# Altium schematic sheet 24-BOOT MODE BUFFER AND SWITCHES.SchDoc
size 513 x 386 mm
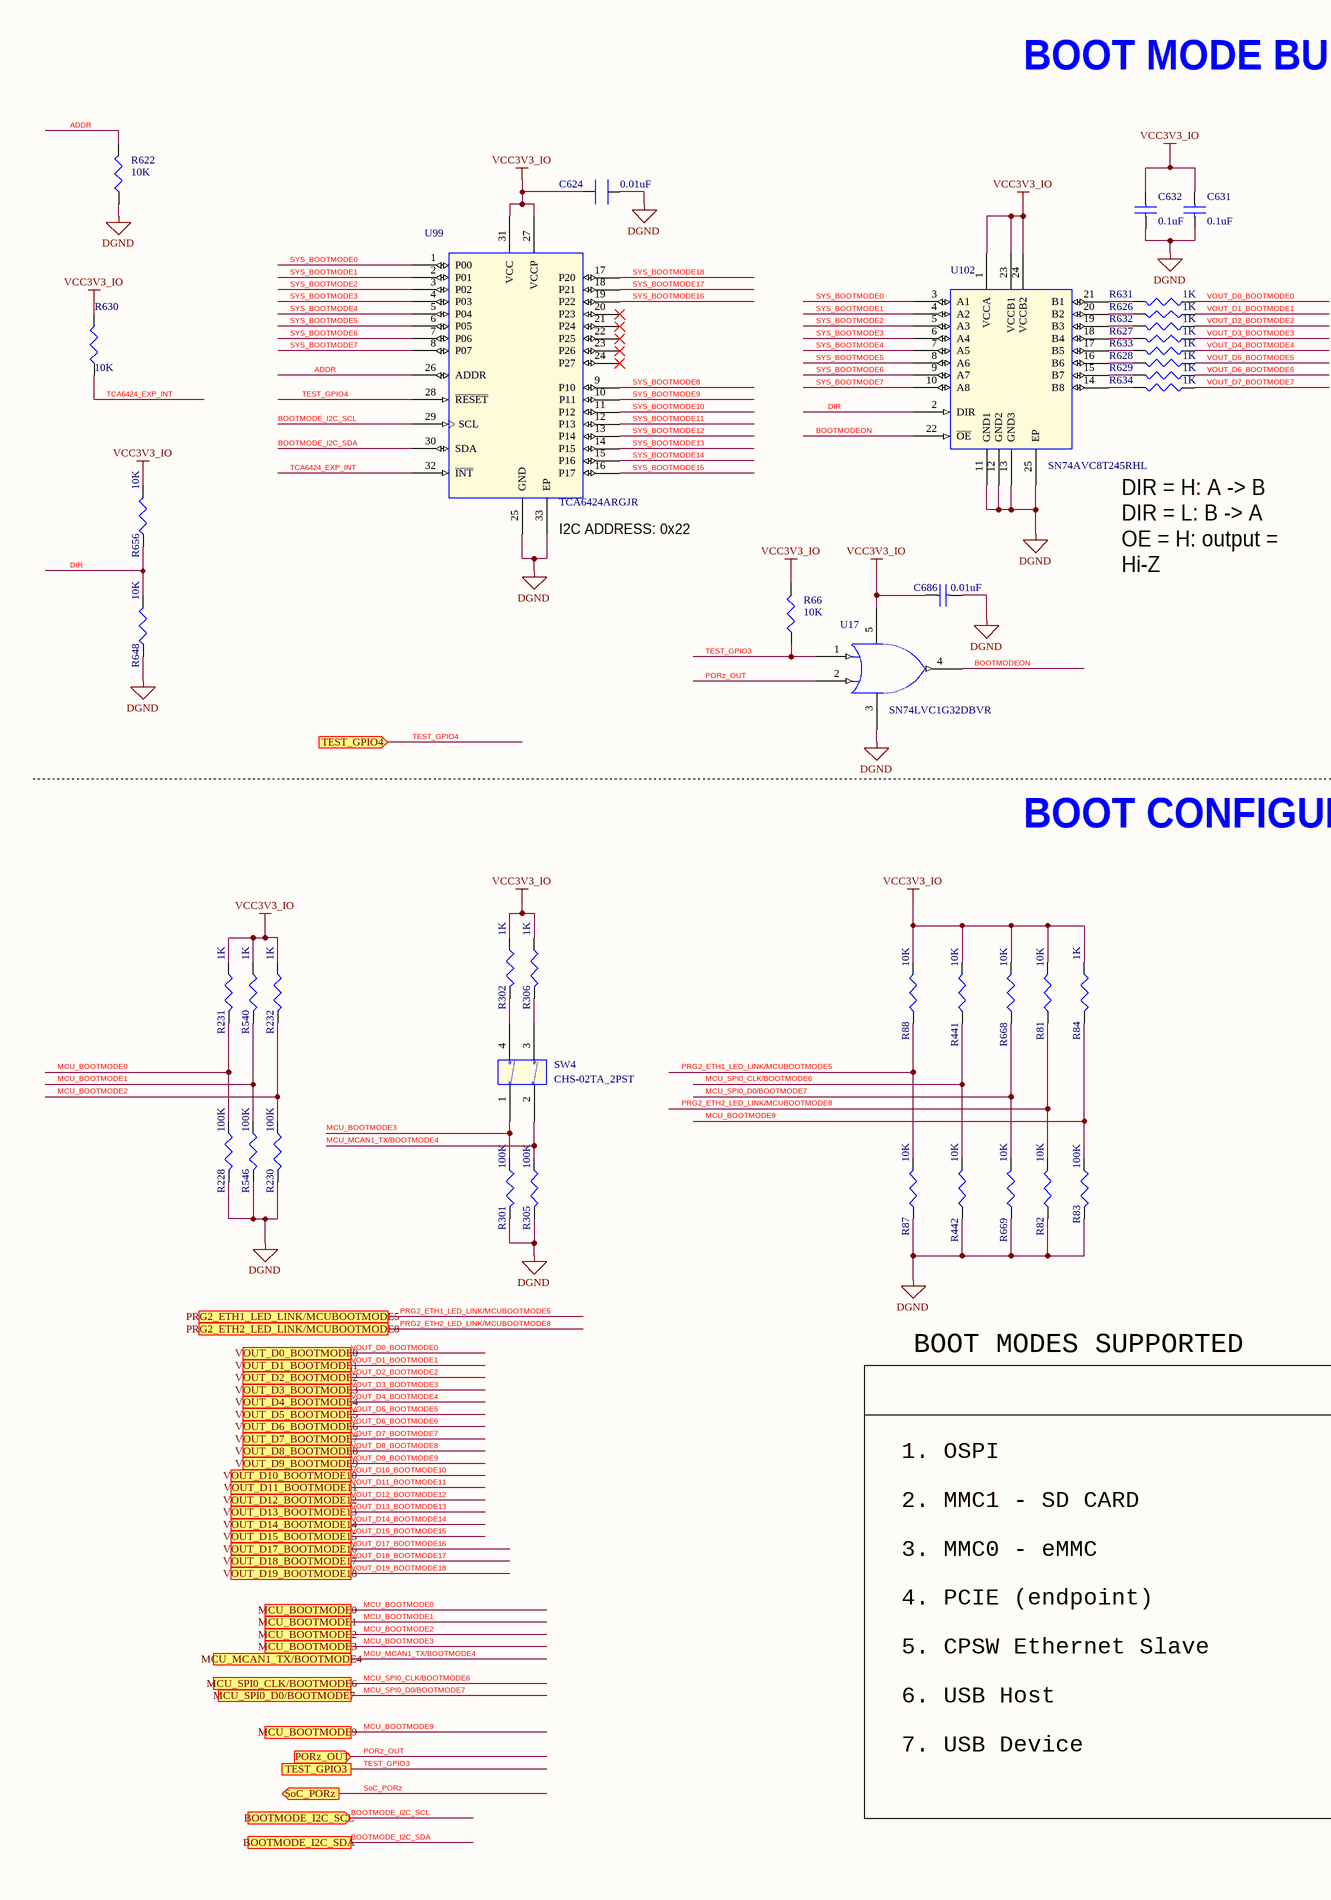
[diagram p0: 24-BOOT MODE BUFFER AND SWITCHES.SchDoc, left]
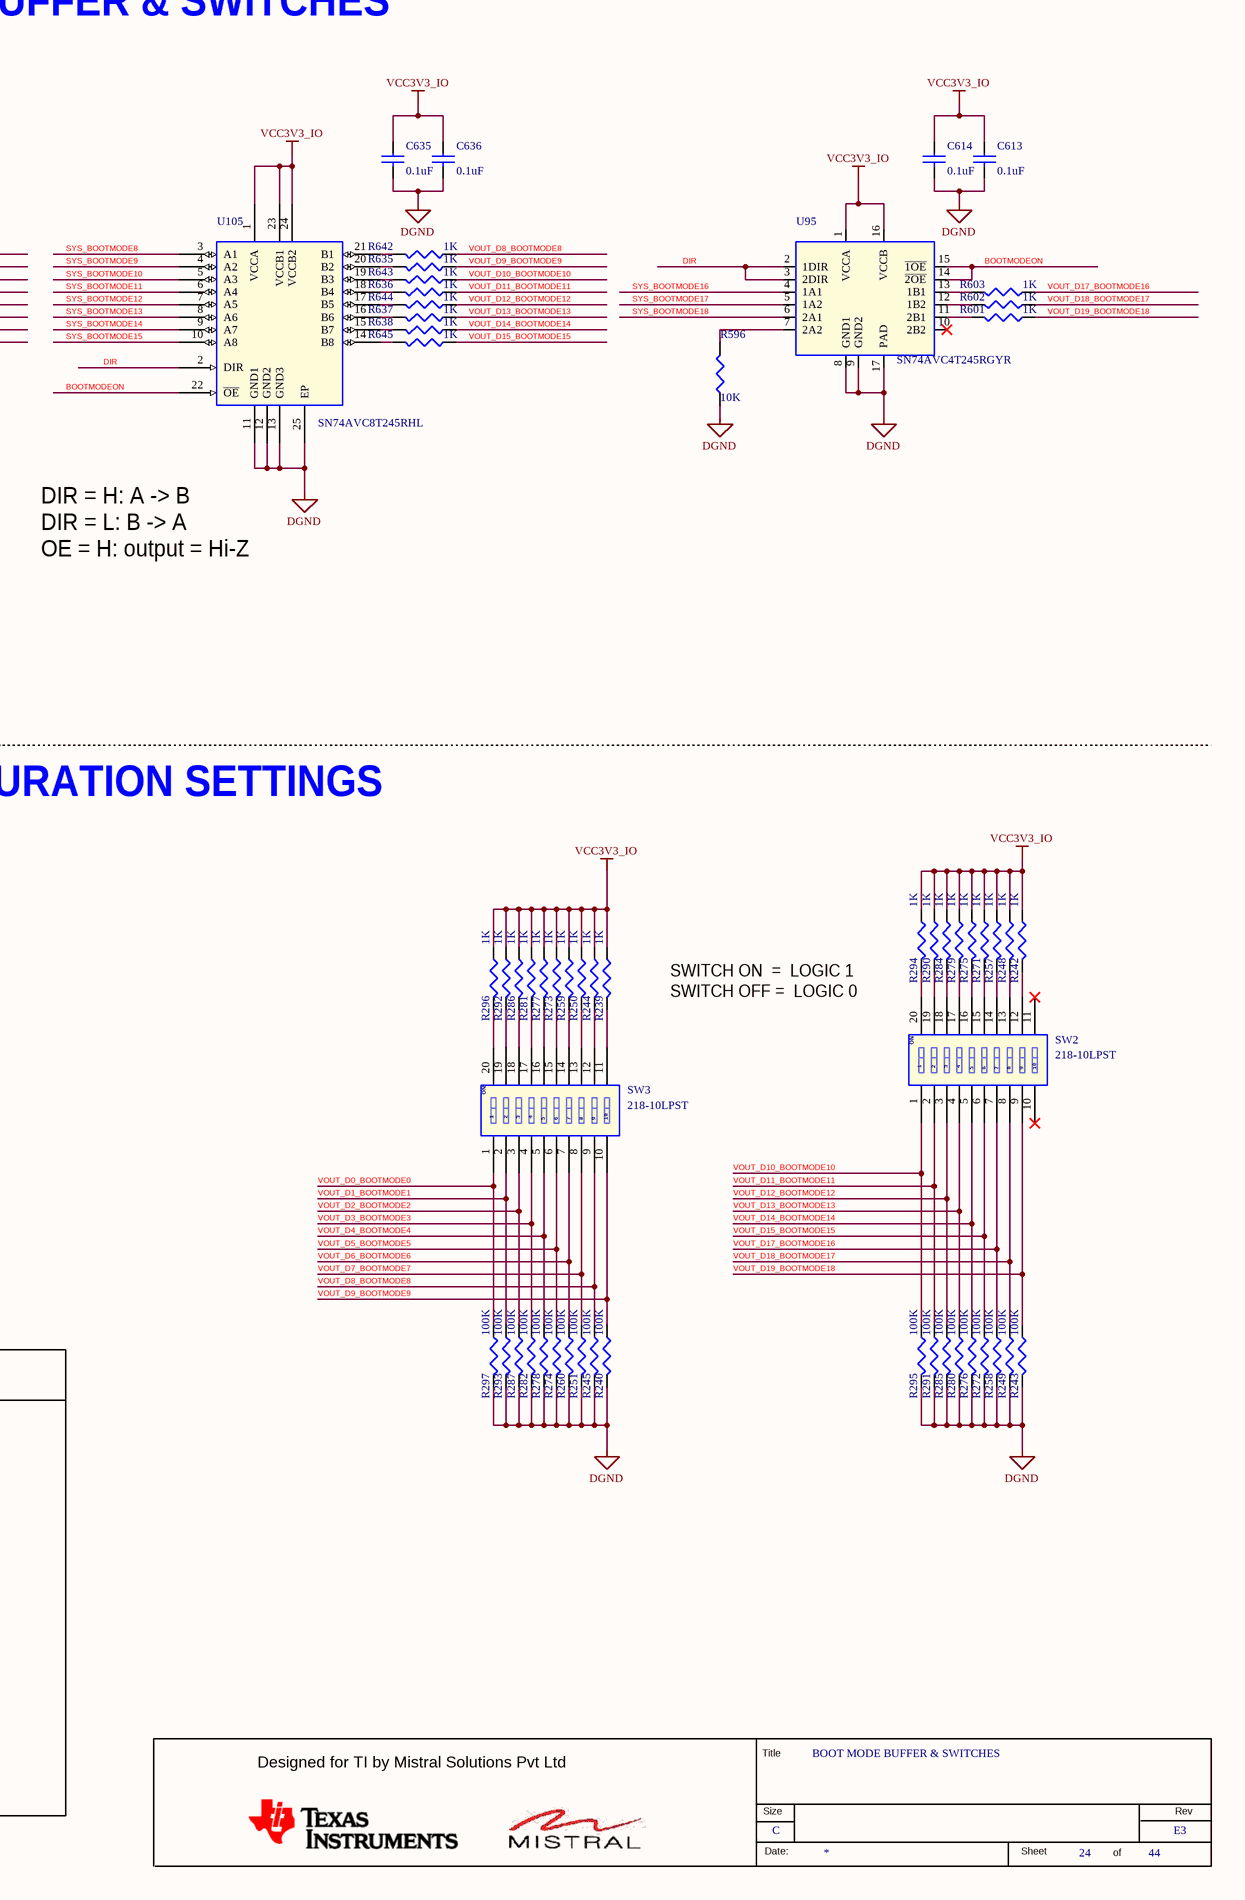
[diagram p1: 24-BOOT MODE BUFFER AND SWITCHES.SchDoc, right]

## Parts
*  RevCode: E3  Title: BOOT MODE BUFFER & SWITCHES  Page Size: C  Page Number: 24  Page Count: 44  (hidden comment: MISTRAL_TITLEBLK_CSIZE)  (graphical)
C613  0.1uF  [CAP0201_0-5]
C614  0.1uF  [CAP0201_0-5]
C624  0.01uF  [CAP0201_0-5]
C631  0.1uF  [CAP0201_0-5]
C632  0.1uF  [CAP0201_0-5]
C635  0.1uF  [CAP0201_0-5]
C636  0.1uF  [CAP0201_0-5]
C686  0.01uF  [CAP0201_0-5]
R66  10K  [RES0402_0-5]
R81  10K  [RES0402_0-5]
R82  10K  [RES0402_0-5]
R83  100K  [RES0402_0-5]
R84  1K  [RES0402]
R87  10K  [RES0402_0-5]
R88  10K  [RES0402_0-5]
R228  100K  [RES0402_0-5]
R230  100K  [RES0402_0-5]
R231  1K  [RES0201]
R232  1K  [RES0201]
R239  1K  [RES0201]
R240  100K  [RES0402_0-5]
R242  1K  [RES0201]
R243  100K  [RES0402_0-5]
R244  1K  [RES0201]
R245  100K  [RES0402_0-5]
R248  1K  [RES0201]
R249  100K  [RES0402_0-5]
R250  1K  [RES0201]
R251  100K  [RES0402_0-5]
R257  1K  [RES0201]
R258  100K  [RES0402_0-5]
R259  1K  [RES0201]
R260  100K  [RES0402_0-5]
R271  1K  [RES0201]
R272  100K  [RES0402_0-5]
R273  1K  [RES0201]
R274  100K  [RES0402_0-5]
R275  1K  [RES0201]
R276  100K  [RES0402_0-5]
R277  1K  [RES0201]
R278  100K  [RES0402_0-5]
R279  1K  [RES0201]
R280  100K  [RES0402_0-5]
R281  1K  [RES0201]
R282  100K  [RES0402_0-5]
R284  1K  [RES0201]
R285  100K  [RES0402_0-5]
R286  1K  [RES0201]
R287  100K  [RES0402_0-5]
R290  1K  [RES0201]
R291  100K  [RES0402_0-5]
R292  1K  [RES0201]
R293  100K  [RES0402_0-5]
R294  1K  [RES0201]
R295  100K  [RES0402_0-5]
R296  1K  [RES0201]
R297  100K  [RES0402_0-5]
R301  100K  [RES0402_0-5]
R302  1K  [RES0201]
R305  100K  [RES0402_0-5]
R306  1K  [RES0201]
R441  10K  [RES0402_0-5]
R442  10K  [RES0402_0-5]
R540  1K  [RES0201]
R546  100K  [RES0402_0-5]
R596  10K  [RES0402_0-5]
R601  1K  [RES0201]
R602  1K  [RES0201]
R603  1K  [RES0201]
R622  10K  [RES0402_0-5]
R626  1K  [RES0201]
R627  1K  [RES0201]
R628  1K  [RES0201]
R629  1K  [RES0201]
R630  10K  [RES0402_0-5]
R631  1K  [RES0201]
R632  1K  [RES0201]
R633  1K  [RES0201]
R634  1K  [RES0201]
R635  1K  [RES0201]
R636  1K  [RES0201]
R637  1K  [RES0201]
R638  1K  [RES0201]
R642  1K  [RES0201]
R643  1K  [RES0201]
R644  1K  [RES0201]
R645  1K  [RES0201]
R648  10K  [RES0402_0-5]
R656  10K  [RES0402_0-5]
R668  10K  [RES0402_0-5]
R669  10K  [RES0402_0-5]
SW2  218-10LPST  [SW10_50_550X230_SMD]
SW3  218-10LPST  [SW10_50_550X230_SMD]
SW4  CHS-02TA_2PST  [SW2_50x200_160x210_SMD]
U17  SN74LVC1G32DBVR  [SOT23-5_1-5]
U95  SN74AVC4T245RGYR  [QFN16_19-68_160X140]
U99  TCA6424ARGJR  [QFN32_19-68_200X200]
U102  SN74AVC8T245RHL  [QFN24_19-68_220X140_1]
U105  SN74AVC8T245RHL  [QFN24_19-68_220X140_1]

## Ports
BOOTMODE_I2C_SCL (in), BOOTMODE_I2C_SDA, MCU_BOOTMODE0, MCU_BOOTMODE1, MCU_BOOTMODE2, MCU_BOOTMODE3, MCU_BOOTMODE9, MCU_MCAN1_TX/BOOTMODE4, MCU_SPI0_CLK/BOOTMODE6, MCU_SPI0_D0/BOOTMODE7, PORz_OUT (in), PRG2_ETH1_LED_LINK/MCUBOOTMODE5, PRG2_ETH2_LED_LINK/MCUBOOTMODE8, SoC_PORz (out), TEST_GPIO3, TEST_GPIO4 (in), VOUT_D0_BOOTMODE0, VOUT_D1_BOOTMODE1, VOUT_D2_BOOTMODE2, VOUT_D3_BOOTMODE3, VOUT_D4_BOOTMODE4, VOUT_D5_BOOTMODE5, VOUT_D6_BOOTMODE6, VOUT_D7_BOOTMODE7, VOUT_D8_BOOTMODE8, VOUT_D9_BOOTMODE9, VOUT_D10_BOOTMODE10, VOUT_D11_BOOTMODE11, VOUT_D12_BOOTMODE12, VOUT_D13_BOOTMODE13, VOUT_D14_BOOTMODE14, VOUT_D15_BOOTMODE15, VOUT_D17_BOOTMODE16, VOUT_D18_BOOTMODE17, VOUT_D19_BOOTMODE18

## Nets
DGND: C613.2 C614.2 C624.1 C631.2 C632.2 C635.2 C636.2 C686.2 R82.1 R83.2 R87.1 R228.2 R230.2 R240.2 R243.2 R245.2 R249.2 R251.2 R258.2 R260.2 R272.2 R274.2 R276.2 R278.2 R280.2 R282.2 R285.2 R287.2 R291.2 R293.2 R295.2 R297.2 R301.2 R305.2 R442.1 R546.2 R596.1 R622.1 R648.1 R669.1 U17.3(GND) U95.8(GND1) U95.9(GND2) U95.17(PAD) U99.25(GND) U99.33(EP) U102.11(GND1) U102.12(GND2) U102.13(GND3) U102.25(EP) U105.11(GND1) U105.12(GND2) U105.13(GND3) U105.25(EP)
VCC3V3_IO: C613.1 C614.1 C624.2 C631.1 C632.1 C635.1 C636.1 C686.1 R66.2 R81.2 R84.1 R88.2 R231.1 R232.1 R239.1 R242.1 R244.1 R248.1 R250.1 R257.1 R259.1 R271.1 R273.1 R275.1 R277.1 R279.1 R281.1 R284.1 R286.1 R290.1 R292.1 R294.1 R296.1 R302.1 R306.1 R441.2 R540.1 R630.2 R656.2 R668.2 U17.5(VCC) U95.1(VCCA) U95.16(VCCB) U99.27(VCCP) U99.31(VCC) U102.1(VCCA) U102.23(VCCB1) U102.24(VCCB2) U105.1(VCCA) U105.23(VCCB1) U105.24(VCCB2)
ADDR: R622.2 U99.26(ADDR)
BOOTMODE_I2C_SCL: U99.29(SCL) ; port BOOTMODE_I2C_SCL
BOOTMODE_I2C_SDA: U99.30(SDA) ; port BOOTMODE_I2C_SDA
BOOTMODEON: U17.4(Y) U95.14(~{2OE}) U95.15(~{1OE}) U102.22(~{OE}) U105.22(~{OE})
DIR: R648.2 R656.1 U95.2(1DIR) U95.3(2DIR) U102.2(DIR) U105.2(DIR)
MCU_BOOTMODE0: R228.1 R231.2 ; port MCU_BOOTMODE0
MCU_BOOTMODE1: R540.2 R546.1 ; port MCU_BOOTMODE1
MCU_BOOTMODE2: R230.1 R232.2 ; port MCU_BOOTMODE2
MCU_BOOTMODE3: R301.1 SW4.1(A1) ; port MCU_BOOTMODE3
MCU_BOOTMODE9: R83.1 R84.2 ; port MCU_BOOTMODE9
MCU_MCAN1_TX/BOOTMODE4: R305.1 SW4.2(A2) ; port MCU_MCAN1_TX/BOOTMODE4
MCU_SPI0_CLK/BOOTMODE6: R441.1 R442.2 ; port MCU_SPI0_CLK/BOOTMODE6
MCU_SPI0_D0/BOOTMODE7: R668.1 R669.2 ; port MCU_SPI0_D0/BOOTMODE7
PORz_OUT: U17.2(B) ; port PORz_OUT
PRG2_ETH1_LED_LINK/MCUBOOTMODE5: R87.2 R88.1 ; port PRG2_ETH1_LED_LINK/MCUBOOTMODE5
PRG2_ETH2_LED_LINK/MCUBOOTMODE8: R81.1 R82.2 ; port PRG2_ETH2_LED_LINK/MCUBOOTMODE8
SoC_PORz: port SoC_PORz
SYS_BOOTMODE0: U99.1(P00) U102.3(A1)
SYS_BOOTMODE1: U99.2(P01) U102.4(A2)
SYS_BOOTMODE2: U99.3(P02) U102.5(A3)
SYS_BOOTMODE3: U99.4(P03) U102.6(A4)
SYS_BOOTMODE4: U99.5(P04) U102.7(A5)
SYS_BOOTMODE5: U99.6(P05) U102.8(A6)
SYS_BOOTMODE6: U99.7(P06) U102.9(A7)
SYS_BOOTMODE7: U99.8(P07) U102.10(A8)
SYS_BOOTMODE8: U99.9(P10) U105.3(A1)
SYS_BOOTMODE9: U99.10(P11) U105.4(A2)
SYS_BOOTMODE10: U99.11(P12) U105.5(A3)
SYS_BOOTMODE11: U99.12(P13) U105.6(A4)
SYS_BOOTMODE12: U99.13(P14) U105.7(A5)
SYS_BOOTMODE13: U99.14(P15) U105.8(A6)
SYS_BOOTMODE14: U99.15(P16) U105.9(A7)
SYS_BOOTMODE15: U99.16(P17) U105.10(A8)
SYS_BOOTMODE16: U95.4(1A1) U99.19(P22)
SYS_BOOTMODE17: U95.5(1A2) U99.18(P21)
SYS_BOOTMODE18: U95.6(2A1) U99.17(P20)
TCA6424_EXP_INT: R630.1 U99.32(~{INT})
TEST_GPIO3: R66.1 U17.1(A) ; port TEST_GPIO3
TEST_GPIO4: U99.28(~{RESET}) ; port TEST_GPIO4
VOUT_D0_BOOTMODE0: R297.1 R631.1 SW3.1 ; port VOUT_D0_BOOTMODE0
VOUT_D1_BOOTMODE1: R293.1 R626.1 SW3.2 ; port VOUT_D1_BOOTMODE1
VOUT_D2_BOOTMODE2: R287.1 R632.1 SW3.3 ; port VOUT_D2_BOOTMODE2
VOUT_D3_BOOTMODE3: R282.1 R627.1 SW3.4 ; port VOUT_D3_BOOTMODE3
VOUT_D4_BOOTMODE4: R278.1 R633.1 SW3.5 ; port VOUT_D4_BOOTMODE4
VOUT_D5_BOOTMODE5: R274.1 R628.1 SW3.6 ; port VOUT_D5_BOOTMODE5
VOUT_D6_BOOTMODE6: R260.1 R629.1 SW3.7 ; port VOUT_D6_BOOTMODE6
VOUT_D7_BOOTMODE7: R251.1 R634.1 SW3.8 ; port VOUT_D7_BOOTMODE7
VOUT_D8_BOOTMODE8: R245.1 R642.1 SW3.9 ; port VOUT_D8_BOOTMODE8
VOUT_D9_BOOTMODE9: R240.1 R635.1 SW3.10 ; port VOUT_D9_BOOTMODE9
VOUT_D10_BOOTMODE10: R295.1 R643.1 SW2.1 ; port VOUT_D10_BOOTMODE10
VOUT_D11_BOOTMODE11: R291.1 R636.1 SW2.2 ; port VOUT_D11_BOOTMODE11
VOUT_D12_BOOTMODE12: R285.1 R644.1 SW2.3 ; port VOUT_D12_BOOTMODE12
VOUT_D13_BOOTMODE13: R280.1 R637.1 SW2.4 ; port VOUT_D13_BOOTMODE13
VOUT_D14_BOOTMODE14: R276.1 R638.1 SW2.5 ; port VOUT_D14_BOOTMODE14
VOUT_D15_BOOTMODE15: R272.1 R645.1 SW2.6 ; port VOUT_D15_BOOTMODE15
VOUT_D17_BOOTMODE16: R258.1 R603.1 SW2.7 ; port VOUT_D17_BOOTMODE16
VOUT_D18_BOOTMODE17: R249.1 R602.1 SW2.8 ; port VOUT_D18_BOOTMODE17
VOUT_D19_BOOTMODE18: R243.1 R601.1 SW2.9 ; port VOUT_D19_BOOTMODE18
NetR239_2: R239.2 SW3.11
NetR242_2: R242.2 SW2.12
NetR244_2: R244.2 SW3.12
NetR248_2: R248.2 SW2.13
NetR250_2: R250.2 SW3.13
NetR257_2: R257.2 SW2.14
NetR259_2: R259.2 SW3.14
NetR271_2: R271.2 SW2.15
NetR273_2: R273.2 SW3.15
NetR275_2: R275.2 SW2.16
NetR277_2: R277.2 SW3.16
NetR279_2: R279.2 SW2.17
NetR281_2: R281.2 SW3.17
NetR284_2: R284.2 SW2.18
NetR286_2: R286.2 SW3.18
NetR290_2: R290.2 SW2.19
NetR292_2: R292.2 SW3.19
NetR294_2: R294.2 SW2.20
NetR296_2: R296.2 SW3.20
NetR302_2: R302.2 SW4.4(B1)
NetR306_2: R306.2 SW4.3(B2)
NetR596_2: R596.2 U95.7(2A2)
NetR601_2: R601.2 U95.11(2B1)
NetR602_2: R602.2 U95.12(1B2)
NetR603_2: R603.2 U95.13(1B1)
NetR626_2: R626.2 U102.20(B2)
NetR627_2: R627.2 U102.18(B4)
NetR628_2: R628.2 U102.16(B6)
NetR629_2: R629.2 U102.15(B7)
NetR631_2: R631.2 U102.21(B1)
NetR632_2: R632.2 U102.19(B3)
NetR633_2: R633.2 U102.17(B5)
NetR634_2: R634.2 U102.14(B8)
NetR635_2: R635.2 U105.20(B2)
NetR636_2: R636.2 U105.18(B4)
NetR637_2: R637.2 U105.16(B6)
NetR638_2: R638.2 U105.15(B7)
NetR642_2: R642.2 U105.21(B1)
NetR643_2: R643.2 U105.19(B3)
NetR644_2: R644.2 U105.17(B5)
NetR645_2: R645.2 U105.14(B8)

Not connected (* = marked no-connect by the designer): SW2 10* 11*; U95 10(2B2)*; U99 20(P23)* 21(P24)* 22(P25)* 23(P26)* 24(P27)*

## Notes on the sheet
- BOOT MODE BUFFER & SWITCHES
- (near U99) I2C ADDRESS: 0x22
- DIR = H: A -> B
  DIR = L: B -> A
  OE = H: output =
  Hi-Z
- DIR = H: A -> B
  DIR = L: B -> A
  OE = H: output = Hi-Z
- BOOT CONFIGURATION SETTINGS
- SWITCH ON  =  LOGIC 1
  SWITCH OFF =  LOGIC 0
- BOOT MODES SUPPORTED
- 1. OSPI
- 2. MMC1 - SD CARD
- 3. MMC0 - eMMC
- 5. CPSW Ethernet Slave
- 4. PCIE (endpoint)
- 6. USB Host
- 7. USB Device
- (in symbol MISTRAL_TITLEBLK_CSIZE) Title; Designed for TI by Mistral Solutions Pvt Ltd; Size; Rev; Date:; Sheet; of
- (in symbol SW10_218-10LPST) ON

## Library data of the parts
* = MISTRAL_TITLEBLK_CSIZE: Issue: 1.0; Page Create Date: March  8, 1995; Page Modify Date: *
C613 C632 C635 = CAP_Dup5: CAP CERAMIC 0.1uF 16V 10% X5R 0201; Part_type: CAPACITORS\CERAMIC; Mfr_part_number: GRM033R61C104KE84J; Mfr_name: MURATA; Mistral Part No: 120009030072-R; Custom_Duty: 15%; Customs_HS_Code: 85322990; Wattage: NA; Project: TI_MAXIE_CPB; Library Ref: CAP; MECHANICAL 3D STEP FILE: CAP0201_0-5; Chkd/date: MANIRAJA/120218; Crtd /date: MANIRAJA/120218; Datasheet: Y:\MIS_DATABASE\DATASHEETS\CAPACITORS\GRM033R61C104KE84.PDF; Temperature: -55°C+85°C; Weight: 0.33mg; Height: 0.33MM; Distributor_part_number: 490-16742-1-ND; Distributor_name: DIGIKEY; Package: 0201; Voltage: 16V; Tolerance: 10%; PCB Footprint: CAP0201_0-5
C614 C631 C636 = CAP_Dup5: CAP CERAMIC 0.1uF 16V 10% X5R 0201; Mistral Part No: 120009030072-R; Mfr_name: MURATA; Mfr_part_number: GRM033R61C104KE84J; Part_type: CAPACITORS\CERAMIC; Project: TI_MAXIE_CPB; Wattage: NA; Customs_HS_Code: 85322990; Custom_Duty: 15%; Library Ref: CAP; Tolerance: 10%; Voltage: 16V; Package: 0201; Distributor_name: DIGIKEY; Distributor_part_number: 490-16742-1-ND; Height: 0.33MM; Weight: 0.33mg; Temperature: -55°C+85°C; Datasheet: Y:\MIS_DATABASE\DATASHEETS\CAPACITORS\GRM033R61C104KE84.PDF; Crtd /date: MANIRAJA/120218; Chkd/date: MANIRAJA/120218; MECHANICAL 3D STEP FILE: CAP0201_0-5; PCB Footprint: CAP0201_0-5
C624 = CAP_Dup3: CAP CERAMIC 0.01uF 25V 10% X5R 0201; Mistral Part No: 120018010007-R; Mfr_name: MURATA; Mfr_part_number: GRM033R61E103KA12J; Part_type: CAPACITORS\CERAMIC; Wattage: NA; Project: TI_MAXIE_CPB; Customs_HS_Code: 85322990; Custom_Duty: 15%; Library Ref: CAP; MECHANICAL 3D STEP FILE: CAP0201_0-5; Temperature: -55°C+85°C; Weight: 0.33mg; Tolerance: 10%; Voltage: 25V; Package: 0201; Distributor_name: DIGIKEY; Distributor_part_number: GRM033R61E103KA12J-ND; Height: 0.33MM; Datasheet: Y:\MIS_DATABASE\DATASHEETS\CAPACITORS\GRM033R61E103KA12.PDF; Crtd /date: MANIRAJA/230118; Chkd/date: MANIRAJA/230118; PCB Footprint: CAP0201_0-5
C686 = CAP_Dup5: CAP CERAMIC 0.01uF 25V 10% X5R 0201; Mistral Part No: 120018010007-R; Mfr_name: MURATA; Mfr_part_number: GRM033R61E103KA12J; Part_type: CAPACITORS\CERAMIC; Wattage: NA; Project: TI_MAXIE_CPB; Customs_HS_Code: 85322990; Custom_Duty: 15%; Library Ref: CAP; PCB Footprint: CAP0201_0-5; MECHANICAL 3D STEP FILE: CAP0201_0-5; Temperature: -55°C+85°C; Weight: 0.33mg; Tolerance: 10%; Voltage: 25V; Package: 0201; Distributor_name: DIGIKEY; Distributor_part_number: GRM033R61E103KA12J-ND; Height: 0.33MM; Datasheet: Y:\MIS_DATABASE\DATASHEETS\CAPACITORS\GRM033R61E103KA12.PDF; Crtd /date: MANIRAJA/230118; Chkd/date: MANIRAJA/230118
R66 R87 R669 = RESISTOR_Dup5: RES 10K 1/16W 5% 0402; Part_type: RESISTORS\FIXED; Mfr_part_number: RC0402JR-0710KL; Mfr_name: YAGEO AMERICA; Mistral Part No: 110009030208-R; Custom_Duty: 15%; Customs_HS_Code: 85332119; Voltage: NA; Project: HSE; Footprint Path: Y:\MIS_DATABASE\Library\ALTIUM_TOOL\PCB_FOOTPRINTS\Altium_Footprint_Lib.PcbLib; Library Path: Y:\MIS_DATABASE\Library\ALTIUM_TOOL\SCHEMATICS_PARTS\MS_DISCRETE_Library.schlib; Footprint Ref: RES0402_0-5; Library Ref: RESISTOR; MECHANICAL 3D STEP FILE: RES0402_0-5; RoHS: Pb-Free; Chkd/date: VASANTHA/061216; Crtd /date: MAZHAR/230805; Datasheet: Y:\MIS_DATABASE\DATASHEETS\RESISTORS\YAGEO-RC0402.PDF; Temperature: -55°C+155°C; Weight: 0.65mg; Height: 0.40MM; Distributor_part_number: 311-10KJRCT-ND; Distributor_name: DIGIKEY; Package: 0402; Wattage: 1/16W; Tolerance: 5%; PCB Footprint: RES0402_0-5
R81 R88 = RESISTOR_Dup5: RES 10K 1/16W 5% 0402; Mistral Part No: 110009030208-R; Mfr_name: YAGEO AMERICA; Mfr_part_number: RC0402JR-0710KL; Part_type: RESISTORS\FIXED; Project: HSE; Voltage: NA; Customs_HS_Code: 85332119; Custom_Duty: 15%; NI_MARK: DNI; Footprint Path: Y:\MIS_DATABASE\Library\ALTIUM_TOOL\PCB_FOOTPRINTS\Altium_Footprint_Lib.PcbLib; Library Path: Y:\MIS_DATABASE\Library\ALTIUM_TOOL\SCHEMATICS_PARTS\MS_DISCRETE_Library.schlib; Footprint Ref: RES0402_0-5; Library Ref: RESISTOR; Tolerance: 5%; Wattage: 1/16W; Package: 0402; Distributor_name: DIGIKEY; Distributor_part_number: 311-10KJRCT-ND; Height: 0.40MM; Weight: 0.65mg; Temperature: -55°C+155°C; Datasheet: Y:\MIS_DATABASE\DATASHEETS\RESISTORS\YAGEO-RC0402.PDF; Crtd /date: MAZHAR/230805; Chkd/date: VASANTHA/061216; RoHS: Pb-Free; MECHANICAL 3D STEP FILE: RES0402_0-5; PCB Footprint: RES0402_0-5
R82 R442 R596 R622 R630 R656 = RESISTOR_Dup5: RES 10K 1/16W 5% 0402; Mistral Part No: 110009030208-R; Mfr_name: YAGEO AMERICA; Mfr_part_number: RC0402JR-0710KL; Part_type: RESISTORS\FIXED; Project: HSE; Voltage: NA; Customs_HS_Code: 85332119; Custom_Duty: 15%; Footprint Path: Y:\MIS_DATABASE\Library\ALTIUM_TOOL\PCB_FOOTPRINTS\Altium_Footprint_Lib.PcbLib; Library Path: Y:\MIS_DATABASE\Library\ALTIUM_TOOL\SCHEMATICS_PARTS\MS_DISCRETE_Library.schlib; Footprint Ref: RES0402_0-5; Library Ref: RESISTOR; PCB Footprint: RES0402_0-5; Tolerance: 5%; Wattage: 1/16W; Package: 0402; Distributor_name: DIGIKEY; Distributor_part_number: 311-10KJRCT-ND; Height: 0.40MM; Weight: 0.65mg; Temperature: -55°C+155°C; Datasheet: Y:\MIS_DATABASE\DATASHEETS\RESISTORS\YAGEO-RC0402.PDF; Crtd /date: MAZHAR/230805; Chkd/date: VASANTHA/061216; RoHS: Pb-Free; MECHANICAL 3D STEP FILE: RES0402_0-5
R83 R228 R546 = RESISTOR_Dup4: RES 100K 1/16W 5% 0402; Mistral Part No: 110011060002-R; Mfr_name: VISHAY; Mfr_part_number: CRCW0402100KJNED; Part_type: RESISTORS\FIXED; Project: AM4515_EVM_LCD; Voltage: NA; Customs_HS_Code: 85332119; Custom_Duty: 15%; NI_MARK: DNI; Library Ref: RESISTOR; MECHANICAL 3D STEP FILE: RES0402_0-5; PCB Footprint: RES0402_0-5; Tolerance: 5%; Wattage: 1/16W; Package: 0402; Distributor_name: DIGIKEY; Distributor_part_number: 541-100KJCT-ND; Height: 0.40MM; Weight: 0.65mg; Temperature: -55°C+155°C; Datasheet: Y:\MIS_DATABASE\DATASHEETS\RESISTORS\CRCW0603.PDF; Crtd /date: BAVISH/010611; Chkd/date: VASANTHA/061216
R84 = RESISTOR_Dup5: RES 1K 1/16W 5% 0402; Mistral Part No: 110010120017-R; Mfr_name: VISHAY; Mfr_part_number: CRCW04021K00JNED; Part_type: RESISTORS\FIXED; Project: TE4; Voltage: NA; Tolerance: 5%; Wattage: 1/16W; Package: 0402; Distributor_name: DIGIKEY; Distributor_part_number: 541-1.0KJCT-ND; Library Ref: RESISTOR; Height: 0.40MM; Weight: NA; Temperature: -55°C+155°C; Datasheet: Y:\MIS_DATABASE\DATASHEETS\RESISTORS\CRCW0603.PDF; Crtd /date: BAVISH/021210; Footprint Path: VALUE IS VAILABLE 2 TIMES; PCB Footprint: RES0402
R230 R240 R249 R251 R272 R274 R285 R287 R295 R297 = RESISTOR_Dup4: RES 100K 1/16W 5% 0402; Mistral Part No: 110011060002-R; Mfr_name: VISHAY; Mfr_part_number: CRCW0402100KJNED; Part_type: RESISTORS\FIXED; Project: AM4515_EVM_LCD; Voltage: NA; Customs_HS_Code: 85332119; Custom_Duty: 15%; Library Ref: RESISTOR; MECHANICAL 3D STEP FILE: RES0402_0-5; Tolerance: 5%; Wattage: 1/16W; Package: 0402; Distributor_name: DIGIKEY; Distributor_part_number: 541-100KJCT-ND; Height: 0.40MM; Weight: 0.65mg; Temperature: -55°C+155°C; Datasheet: Y:\MIS_DATABASE\DATASHEETS\RESISTORS\CRCW0603.PDF; Crtd /date: BAVISH/010611; Chkd/date: VASANTHA/061216; PCB Footprint: RES0402_0-5
R231 R242 R244 R257 R259 R275 R277 R284 R286 R292 R294 R296 R602 R626-R628 R634-R637 R645 = RESISTOR_Dup4: RES 1K 1/20W 5% 0201; Part_type: RESISTORS\FIXED; Mfr_part_number: CRCW02011K00FKED; Mfr_name: VISHAY; Mistral Part No: 110015080014-R; Custom_Duty: 15%; Customs_HS_Code: 85332119; Voltage: NA; Project: OCTASIC_3000; Library Ref: RESISTOR; Chkd/date: JEBRAN/110815; Crtd /date: JEBRAN/110815; Datasheet: Y:\MIS_DATABASE\DATASHEETS\RESISTORS\CRCW0201.PDF; Temperature: -55°C+155°C; Weight: NA; Height: 0.28MM; Distributor_part_number: 541-1.00KAABCT-ND; Distributor_name: DIGIKEY; Package: 0201; Wattage: 1/20W; Tolerance: 5%; PCB Footprint: RES0201
R232 = RESISTOR_Dup4: RES 1K 1/20W 5% 0201; Mistral Part No: 110015080014-R; Mfr_name: VISHAY; Mfr_part_number: CRCW02011K00FKED; Part_type: RESISTORS\FIXED; Project: OCTASIC_3000; Voltage: NA; Customs_HS_Code: 85332119; Custom_Duty: 15%; NI_MARK: DNI; Library Ref: RESISTOR; Tolerance: 5%; Wattage: 1/20W; Package: 0201; Distributor_name: DIGIKEY; Distributor_part_number: 541-1.00KAABCT-ND; Height: 0.28MM; Weight: NA; Temperature: -55°C+155°C; Datasheet: Y:\MIS_DATABASE\DATASHEETS\RESISTORS\CRCW0201.PDF; Crtd /date: JEBRAN/110815; Chkd/date: JEBRAN/110815; PCB Footprint: RES0201
R239 R248 R250 R271 R273 R279 R281 R290 R302 R306 R540 R601 R603 R629 R631-R633 R638 R642-R644 = RESISTOR_Dup4: RES 1K 1/20W 5% 0201; Mistral Part No: 110015080014-R; Mfr_name: VISHAY; Mfr_part_number: CRCW02011K00FKED; Part_type: RESISTORS\FIXED; Project: OCTASIC_3000; Voltage: NA; Customs_HS_Code: 85332119; Custom_Duty: 15%; Library Ref: RESISTOR; Tolerance: 5%; Wattage: 1/20W; Package: 0201; Distributor_name: DIGIKEY; Distributor_part_number: 541-1.00KAABCT-ND; Height: 0.28MM; Weight: NA; Temperature: -55°C+155°C; Datasheet: Y:\MIS_DATABASE\DATASHEETS\RESISTORS\CRCW0201.PDF; Crtd /date: JEBRAN/110815; Chkd/date: JEBRAN/110815; PCB Footprint: RES0201
R243 R245 R258 R260 R276 R278 R280 R282 R291 R293 R301 R305 = RESISTOR_Dup4: RES 100K 1/16W 5% 0402; Part_type: RESISTORS\FIXED; Mfr_part_number: CRCW0402100KJNED; Mfr_name: VISHAY; Mistral Part No: 110011060002-R; Custom_Duty: 15%; Customs_HS_Code: 85332119; Voltage: NA; Project: AM4515_EVM_LCD; Library Ref: RESISTOR; MECHANICAL 3D STEP FILE: RES0402_0-5; PCB Footprint: RES0402_0-5; Chkd/date: VASANTHA/061216; Crtd /date: BAVISH/010611; Datasheet: Y:\MIS_DATABASE\DATASHEETS\RESISTORS\CRCW0603.PDF; Temperature: -55°C+155°C; Weight: 0.65mg; Height: 0.40MM; Distributor_part_number: 541-100KJCT-ND; Distributor_name: DIGIKEY; Package: 0402; Wattage: 1/16W; Tolerance: 5%
R441 R648 R668 = RESISTOR_Dup5: RES 10K 1/16W 5% 0402; Part_type: RESISTORS\FIXED; Mfr_part_number: RC0402JR-0710KL; Mfr_name: YAGEO AMERICA; Mistral Part No: 110009030208-R; Custom_Duty: 15%; Customs_HS_Code: 85332119; Voltage: NA; Project: HSE; NI_MARK: DNI; Footprint Path: Y:\MIS_DATABASE\Library\ALTIUM_TOOL\PCB_FOOTPRINTS\Altium_Footprint_Lib.PcbLib; Library Path: Y:\MIS_DATABASE\Library\ALTIUM_TOOL\SCHEMATICS_PARTS\MS_DISCRETE_Library.schlib; Footprint Ref: RES0402_0-5; Library Ref: RESISTOR; PCB Footprint: RES0402_0-5; MECHANICAL 3D STEP FILE: RES0402_0-5; RoHS: Pb-Free; Chkd/date: VASANTHA/061216; Crtd /date: MAZHAR/230805; Datasheet: Y:\MIS_DATABASE\DATASHEETS\RESISTORS\YAGEO-RC0402.PDF; Temperature: -55°C+155°C; Weight: 0.65mg; Height: 0.40MM; Distributor_part_number: 311-10KJRCT-ND; Distributor_name: DIGIKEY; Package: 0402; Wattage: 1/16W; Tolerance: 5%
SW2 = SW10_218-10LPST: SWITCH DIP SPST HALF PITCH 10POS SMD; Part No (Manufacturer): GDH06S04 (Tyco Electronics); Mistral Part No: 130016080032-R; Mfr_name: CTS; Part_type: ELECTRO-MECHANICAL\SWITCH; Compliance: RoHS; Component Name: DIP Sw_GDH06S04; Project: EPOS_EVM; Tolerance: NA; Customs_HS_Code: 85369090; Custom_Duty: 24%; Operating Temp Range: -30 to 85C; Type: DIP; Library Ref: SW10_218-10LPST; Mfr_part_number: 218-10LPST; Voltage: NA; Wattage: NA; Package: SMD; Distributor_name: DIGIKEY; Distributor_part_number: CT21810LPST-ND; Height: 2.65MM; Weight: NA; Temperature: -55°C+85°C; Datasheet: Y:\MIS_DATABASE\DATASHEETS\MISC\SWITCHES\128-12LPST.PDF; Crtd /date: VASANTHA/250816; Chkd/date: VASANTHA/250816; PCB Footprint: SW10_50_550X230_SMD
SW3 = SW10_218-10LPST: SWITCH DIP SPST HALF PITCH 10POS SMD; Part No (Manufacturer): GDH06S04 (Tyco Electronics); Part_type: ELECTRO-MECHANICAL\SWITCH; Mfr_name: CTS; Mistral Part No: 130016080032-R; Compliance: RoHS; Component Name: DIP Sw_GDH06S04; Custom_Duty: 24%; Customs_HS_Code: 85369090; Wattage: NA; Project: EPOS_EVM; Operating Temp Range: -30 to 85C; Type: DIP; Library Ref: SW10_218-10LPST; Chkd/date: VASANTHA/250816; Crtd /date: VASANTHA/250816; Datasheet: Y:\MIS_DATABASE\DATASHEETS\MISC\SWITCHES\128-12LPST.PDF; Temperature: -55°C+85°C; Weight: NA; Height: 2.65MM; Distributor_part_number: CT21810LPST-ND; Distributor_name: DIGIKEY; Package: SMD; Voltage: NA; Tolerance: NA; Mfr_part_number: 218-10LPST; PCB Footprint: SW10_50_550X230_SMD
SW4 = SW4_CHS-02TA: SWITCH SLIDE 2PST SMD; Mistral Part No: 130011120001-R; Mfr_name: COPAL ELECTRONICS; Part_type: ELECTRO-MECHANICAL\SWITCH; Project: AVCDP1; Tolerance: NA; Customs_HS_Code: 85369090; Custom_Duty: 24%; Library Ref: SW4_CHS-02TA; Mfr_part_number: CHS-02TA; Voltage: NA; Wattage: NA; Package: SMD; Distributor_name: DIGIKEY; Distributor_part_number: 563-1005-1-ND; Height: 2.50MM; Weight: 0.08g; Temperature: -40°C+85°C; Datasheet: Y:\MIS_DATABASE\DATASHEETS\MISC\SWITCHES\CHSSER.PDF; Crtd /date: CHAITHANYA/021211; Chkd/date: MAZHAR/021211; PCB Footprint: SW2_50x200_160x210_SMD
U17 = SN74LVC1G32DBVR_SOT23-5: IC SINGAL 2 INPUT POSITIVE OR GATE SOT23-5; Mistral Part No: 141009030236-R; Mfr_name: TEXAS INSTRUMENTS; Part_type: ICS\DIGITAL\GATES; Project: SVDO_RMB_MMA; Tolerance: NA; Customs_HS_Code: 85423100; Custom_Duty: 15%; Library Ref: SN74LVC1G32DBVR_SOT23-5; PCB Footprint: SOT23-5_1-5; Mfr_part_number: SN74LVC1G32DBVR; Voltage: NA; Wattage: NA; Package: SOT23-5; Distributor_name: DIGIKEY; Distributor_part_number: 296-9847-1-ND; Height: 1.45MM; Weight: 6.3mg; Temperature: -40°C+85°C; Datasheet: Y:\MIS_DATABASE\DATASHEETS\ICS\DIGITAL\GATES\SN74LVC1G32.PDF; Crtd /date: MAZHAR/070806; Chkd/date: MANIRAJA/051017; MECHANICAL 3D STEP FILE: SOT23-5_1-5
U95 = SN74AVC4T245RGYR_QFN16: IC 4-BIT DUAL SUPPLY BUS TRANSCEIVER QFN16; Mistral Part No: 141009030112-R; Mfr_name: TEXAS INSTRUMENTS; Part_type: ICS\DIGITAL\COMBINATIONAL; Project: HS100RD; Customs_HS_Code: 85423100; Custom_Duty: 15%; Library Ref: SN74AVC4T245RGYR_QFN16; Mfr_part_number: SN74AVC4T245RGYR; Package: QFN16; Distributor_name: DIGIKEY; Distributor_part_number: 296-18231-1-ND; Height: 1.00MM; Datasheet: Y:\MIS_DATABASE\DATASHEETS\ICS\DIGITAL\BUSTRANSCEIVER\SN74AVC4T245XXXX.PDF; Crtd /date: USMAN/060308; Chkd/date: MAZHAR/060308; RoHS: Sb/ Br FREE; PCB Footprint: QFN16_19-68_160X140
U99 = TCA6424ARGJR_QFN32: IC I2C I/O EXPANDER 24B UQFN32; Part_type: ICS\DIGITAL\BUSTRANSCEIVER; Mfr_name: TEXAS INSTRUMENTS; Mistral Part No: 141014090009-R; Custom_Duty: 15%; Customs_HS_Code: 85423100; Project: ZK_BIOMETRIC; Library Ref: TCA6424ARGJR_QFN32; Chkd/date: NAVEED/100715; Crtd /date: NAVEED/100914; Datasheet: Y:\MIS_DATABASE\DATASHEETS\ICS\DIGITAL\BUSTRANSCEIVER\TCA6424AR.PDF; Temperature: -40°C+85°C; Weight: NA; Height: 0.60MM; Distributor_part_number: 296-27844-1-ND; Distributor_name: DIGIKEY; Package: UQFN32; Mfr_part_number: TCA6424ARGJR; PCB Footprint: QFN32_19-68_200X200
U102 U105 = SN74AVC8T245RHL_QFN24: IC BUS TRANSCEIVER 8-BIT DUAL-SUPPLY QFN24; Mistral Part No: 143011040001-R; Mfr_name: TEXAS INSTRUMENTS; Mfr_part_number: SN74AVC8T245RHLR; Part_type: ICS\TELECOM\TRANSCEIVER; Project: OMAPL1_PEC20; Tolerance: NA; Customs_HS_Code: 85423100; Custom_Duty: 15%; Library Ref: SN74AVC8T245RHL_QFN24; Voltage: NA; Wattage: NA; Package: QFN24; Distributor_name: DIGIKEY; Distributor_part_number: 296-17859-1-ND; Height: 1.00MM; Weight: NA; Temperature: -40°C+85°C; Datasheet: Y:\MIS_DATABASE\DATASHEETS\ICS\DIGITAL\BUSTRANSCEIVER\SN74AVC8T245.PDF; Crtd /date: BAVISH/290411; Chkd/date: VASANTHA/231216; MECHANICAL 3D STEP FILE: QFN24_19-68_220X140_1; PCB Footprint: QFN24_19-68_220X140_1